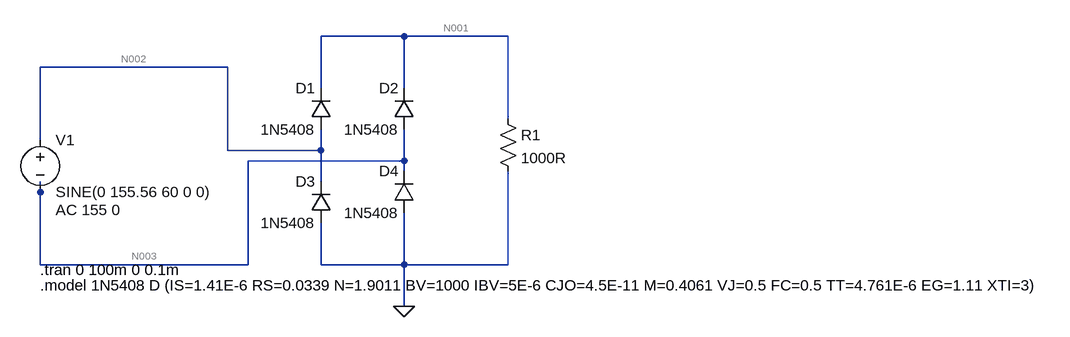
[diagram p0: schematic rectificador monofasico de onda completa_1N5408.asc]
rectificador monofasico de onda completa_1N5408.asc, the LTspice schematic file:
Version 4.1
SHEET 1 1496 680
WIRE 384 -16 256 -16
WIRE 544 -16 384 -16
WIRE 112 32 -176 32
WIRE 256 64 256 -16
WIRE 384 64 384 -16
WIRE 544 112 544 -16
WIRE -176 144 -176 32
WIRE 112 160 112 32
WIRE 256 160 256 128
WIRE 256 160 112 160
WIRE 384 176 384 128
WIRE 384 176 144 176
WIRE 384 192 384 176
WIRE 256 208 256 160
WIRE -176 224 -176 208
WIRE -176 336 -176 224
WIRE 144 336 144 176
WIRE 144 336 -176 336
WIRE 256 336 256 272
WIRE 384 336 384 256
WIRE 384 336 256 336
WIRE 544 336 544 192
WIRE 544 336 384 336
WIRE 384 400 384 336
FLAG 384 400 0
SYMBOL voltage -176 128 R0
WINDOW 123 24 124 Left 2
WINDOW 39 0 0 Left 0
SYMATTR Value2 AC 155 0
SYMATTR InstName V1
SYMATTR Value SINE(0 155.56 60 0 0)
SYMBOL diode 400 128 R180
WINDOW 0 24 64 Left 2
WINDOW 3 24 0 Left 2
SYMATTR InstName D2
SYMATTR Value 1N5408
SYMBOL diode 272 128 R180
WINDOW 0 24 64 Left 2
WINDOW 3 24 0 Left 2
SYMATTR InstName D1
SYMATTR Value 1N5408
SYMBOL res 528 96 R0
SYMATTR InstName R1
SYMATTR Value 1000R
SYMBOL diode 272 272 R180
WINDOW 0 24 64 Left 2
WINDOW 3 24 0 Left 2
SYMATTR InstName D3
SYMATTR Value 1N5408
SYMBOL diode 400 256 R180
WINDOW 0 24 64 Left 2
WINDOW 3 24 0 Left 2
SYMATTR InstName D4
SYMATTR Value 1N5408
TEXT -176 344 Left 2 !.tran 0 100m 0 0.1m
TEXT -176 368 Left 2 !.model 1N5408 D (IS=1.41E-6 RS=0.0339 N=1.9011 BV=1000 IBV=5E-6 CJO=4.5E-11 M=0.4061 VJ=0.5 FC=0.5 TT=4.761E-6 EG=1.11 XTI=3)

The netlist it stands for:
* rectificador monofasico de onda completa_1N5408.asc
V1 N002 N003 SINE(0 155.56 60 0 0) AC 155 0
D2 N003 N001 1N5408
D1 N002 N001 1N5408
R1 N001 0 1000R
D3 0 N002 1N5408
D4 0 N003 1N5408
.model D D
.lib standard.dio
.tran 0 100m 0 0.1m
.model 1N5408 D (IS=1.41E-6 RS=0.0339 N=1.9011 BV=1000 IBV=5E-6 CJO=4.5E-11 M=0.4061 VJ=0.5 FC=0.5 TT=4.761E-6 EG=1.11 XTI=3)
.backanno
.end

* Results of the author's LTspice run, read from the files saved beside the schematic
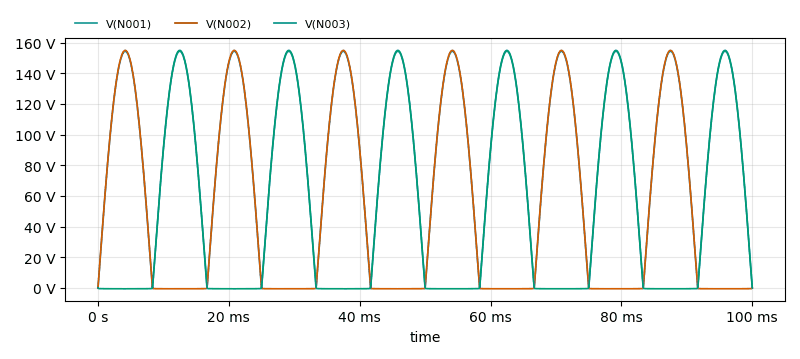
[diagram p1: Transient Analysis of rectificador monofasico de onda completa_1N5408.asc, plotted from the saved traces]
* Transient Analysis, 1 run:
*   V(N001): min -159.1 mV, max 154.4 V, average 97.94 V, rms 109 V, last -60.86 mV
*   V(N002): min -575.8 mV, max 155 V, average 48.97 V, rms 77.42 V, last -30.43 mV
*   V(N003): min -575.8 mV, max 155 V, average 48.97 V, rms 77.42 V, last -30.43 mV